# EAGLE schematic rangkaian skematik (EAGLE 7.6.0)
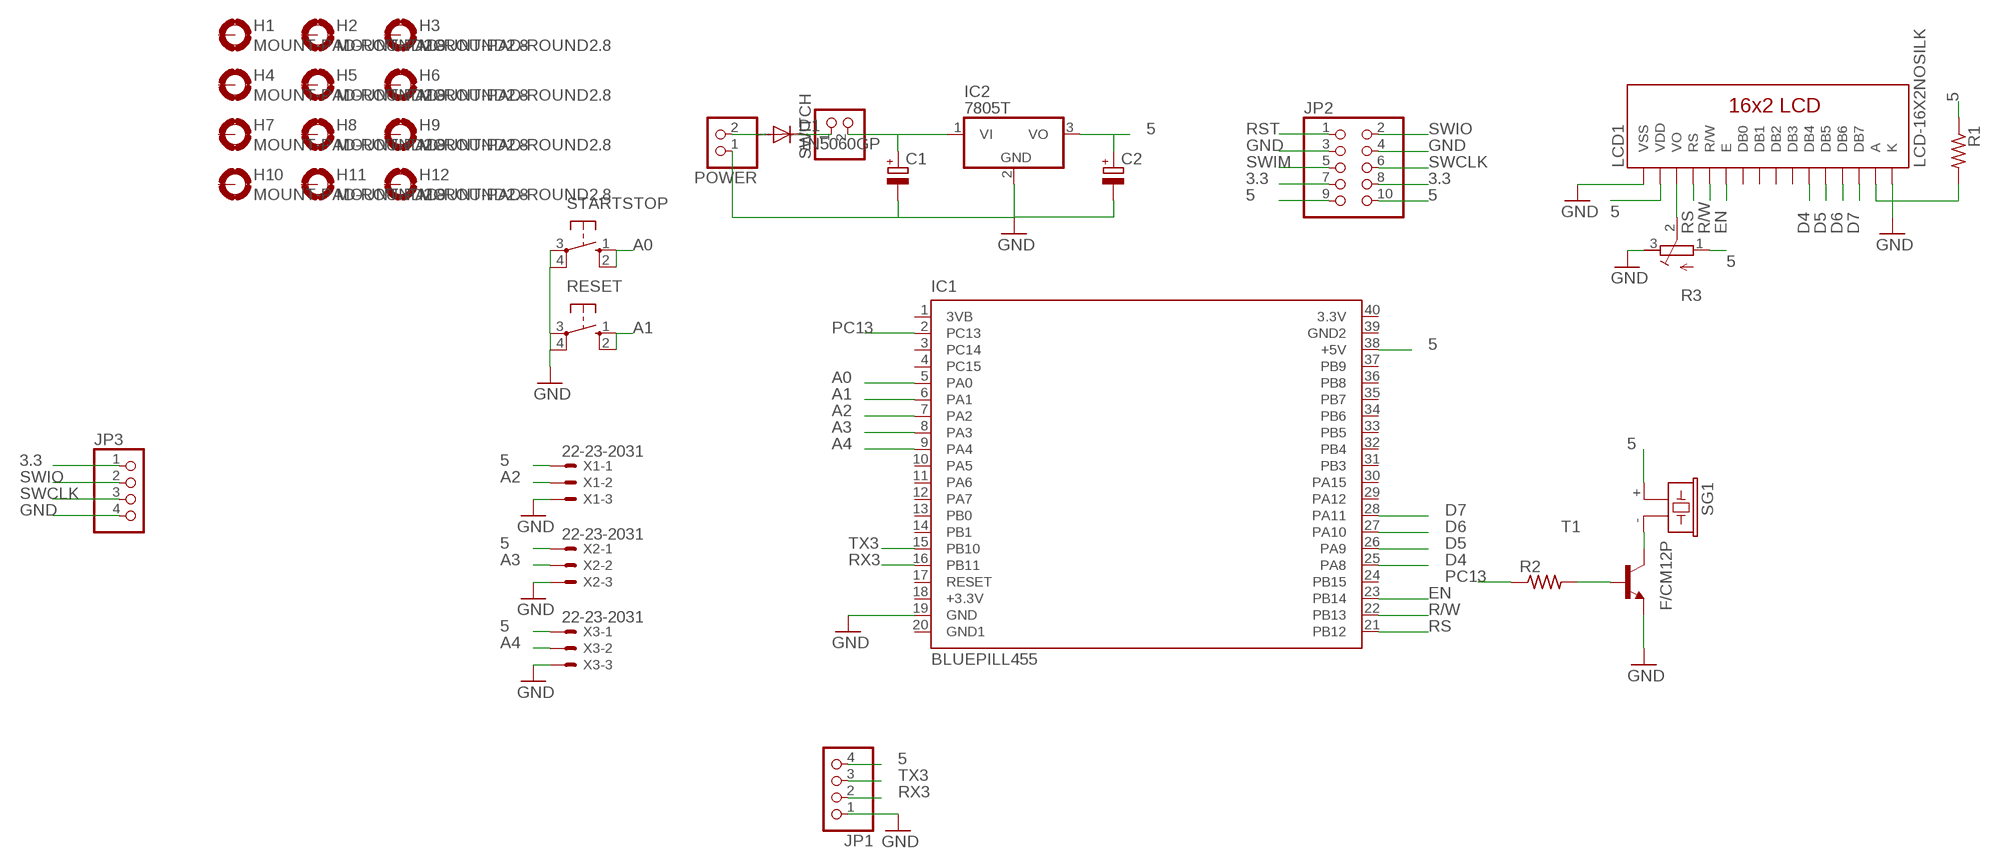
[diagram p0: schematic, sheet 1]

## Parts
C1  CPOL-EUE2.5-7  [E2,5-7]
C2  CPOL-EUE2.5-6  [E2,5-6]
D1  1N5060GP  [DO15-12]
H1  MOUNT-PAD-ROUND2.8  [2,8-PAD]
H2  MOUNT-PAD-ROUND2.8  [2,8-PAD]
H3  MOUNT-PAD-ROUND2.8  [2,8-PAD]
H4  MOUNT-PAD-ROUND2.8  [2,8-PAD]
H5  MOUNT-PAD-ROUND2.8  [2,8-PAD]
H6  MOUNT-PAD-ROUND2.8  [2,8-PAD]
H7  MOUNT-PAD-ROUND2.8  [2,8-PAD]
H8  MOUNT-PAD-ROUND2.8  [2,8-PAD]
H9  MOUNT-PAD-ROUND2.8  [2,8-PAD]
H10  MOUNT-PAD-ROUND2.8  [2,8-PAD]
H11  MOUNT-PAD-ROUND2.8  [2,8-PAD]
H12  MOUNT-PAD-ROUND2.8  [2,8-PAD]
IC1  BLUEPILL455  [DIL40]
IC2  7805T  [TO220H]
JP1  PINHD-1X4  [1X04]
JP2  PINHD-2X5  [2X05]
JP3  PINHD-1X4  [1X04]
LCD1  LCD-16X2NOSILK  [LCD-16X2_NOSILK]
POWER  PINHD-1X2  [1X02]
R1  R-US_0207/10  [0207/10]
R2  R-US_M0805  [M0805]
R3  R-TRIMM3339P  [RTRIM3339P]
RESET  40-XX  [B3F-40XX]
SG1  F/CM12P  [F/CM12P]
STARTSTOP  40-XX  [B3F-40XX]
SWITCH  PINHD-1X2  [1X02]
T1  BF820-NPN-SOT23-BEC  [SOT23-BEC]
X1  22-23-2031  [22-23-2031]
X2  22-23-2031  [22-23-2031]
X3  22-23-2031  [22-23-2031]

## Nets
3.3: JP2.7 JP2.8 JP3.1
5: C2.+ IC1.38(+5V) IC2.3(VO) JP1.4 JP2.9 JP2.10 LCD1.2(VDD) R1.1 R3.1(A) SG1.+ X1.1 X2.1 X3.1
A0: IC1.5(PA0) STARTSTOP.1(S) STARTSTOP.2(S1)
A1: IC1.6(PA1) RESET.1(S) RESET.2(S1)
A2: IC1.7(PA2) X1.2
A3: IC1.8(PA3) X2.2
A4: IC1.9(PA4) X3.2
D4: IC1.25(PA8) LCD1.11(DB4)
D5: IC1.26(PA9) LCD1.12(DB5)
D6: IC1.27(PA10) LCD1.13(DB6)
D7: IC1.28(PA11) LCD1.14(DB7)
EN: IC1.23(PB14) LCD1.6(E)
GND: C1.- C2.- IC1.19(GND) IC2.2(GND) JP1.1 JP2.3 JP2.4 JP3.4 LCD1.1(VSS) LCD1.16(K) POWER.1 R3.3(E) RESET.3(P) RESET.4(P1) STARTSTOP.3(P) STARTSTOP.4(P1) T1.E X1.3 X2.3 X3.3
N$1: LCD1.15(A) R1.2
N$2: R2.2 T1.B
N$9: C1.+ IC2.1(VI) SWITCH.2
N$10: SG1.- T1.C
N$12: LCD1.3(VO) R3.2(S)
N$13: D1.C SWITCH.1
N$14: D1.A POWER.2
PC13: IC1.2(PC13) R2.1
R/W: IC1.22(PB13) LCD1.5(R/W)
RS: IC1.21(PB12) LCD1.4(RS)
RST: JP2.1
RX3: IC1.16(PB11) JP1.2
SWCLK: JP2.6 JP3.3
SWIM: JP2.5
SWIO: JP2.2 JP3.2
TX3: IC1.15(PB10) JP1.3
Unconnected: H1.B2,8(MOUNT) H2.B2,8(MOUNT) H3.B2,8(MOUNT) H4.B2,8(MOUNT) H5.B2,8(MOUNT) H6.B2,8(MOUNT) H7.B2,8(MOUNT) H8.B2,8(MOUNT) H9.B2,8(MOUNT) H10.B2,8(MOUNT) H11.B2,8(MOUNT) H12.B2,8(MOUNT) IC1.1(3VB) IC1.3(PC14) IC1.4(PC15) IC1.10(PA5) IC1.13(PB0) IC1.14(PB1) IC1.17(RESET) IC1.18(+3.3V) IC1.20(GND1) IC1.24(PB15) IC1.29(PA12) IC1.30(PA15) IC1.33(PB5) IC1.34(PB6) IC1.35(PB7) IC1.36(PB8) IC1.37(PB9) IC1.39(GND2) IC1.40(3.3V) LCD1.7(DB0) LCD1.8(DB1) LCD1.9(DB2) LCD1.10(DB3)

## Power pins joined to a net without a drawn wire
PA6: IC1.11(PA6)
PA7: IC1.12(PA7)
PB3: IC1.31(PB3)
PB4: IC1.32(PB4)

## Library data of the parts
C1 C2 = resistor:CPOL-EU: POLARIZED CAPACITOR, European symbol
D1 = diode:1N5060GP: DIODE controlled avalanche rectifier
H1-H12 = holes:MOUNT-PAD-ROUND: MOUNTING PAD, round
IC1 = STM32BluePill:BLUEPILL: BluePill STM32F108T6 Dev Board Source: http://www.stm32duino.com; 0: x; MF: BluePill; MPN: BluePill; X: 0
IC2 = linear:78*: Positive VOLTAGE REGULATOR Source: http://cache.national.com/ds/LM/LM78L05.pdf http://www.fairchildsemi.com/ds/LM/LM7805.pdf
JP1 JP3 = pinhead:PINHD-1X4: PIN HEADER
JP2 = pinhead:PINHD-2X5: PIN HEADER
LCD1 = SparkFun-Displays:LCD-16X2: Standard text-only 16x2 parallel input LCD Basic 16 character by 2 line display. Typically utilizes the extremely common HD44780 parallel interface chipset SparkFun Products: Basic 16x2 Green <https://www.sparkfun.com/products/255> Basic 8x2 Green <https://www.sparkfun.com/products/11122>; SF_ID: LCD-00255
POWER SWITCH = pinhead:PINHD-1X2: PIN HEADER
R1 R2 = resistor:R-US_: RESISTOR, American symbol
R3 = resistor:R-TRIMM: Trimm resistor
RESET STARTSTOP = switch-omron:40-XX: OMRON SWITCH; MF: OMRON COMPONENTS USA; MPN: B3F-4000; OC_FARNELL: 176434; OC_NEWARK: 36K3105
SG1 = buzzer:F/CM12P: BUZZER Source: Buerklin; OC_FARNELL: unknown; OC_NEWARK: unknown
T1 = transistor:*-NPN-: NPN Transistror BF959 corrected 2008.03.06
X1-X3 = con-molex:22-23-2031: .100" (2.54mm) Center Header - 3 Pin; MF: MOLEX; MPN: 22-23-2031; OC_FARNELL: 1462950; OC_NEWARK: 30C0862